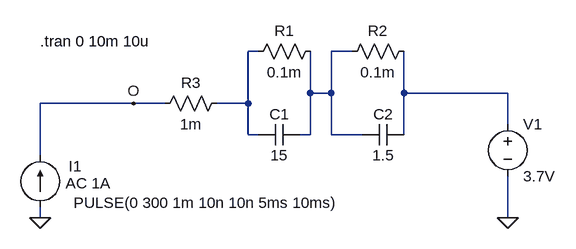
[diagram p0: schematic Lithium-Ion Battery Model - Current Pulse Simulation.asc]
Lithium-Ion Battery Model - Current Pulse Simulation.asc, the LTspice schematic file:
Version 4
SHEET 1 880 680
WIRE 128 48 112 48
WIRE 272 48 240 48
WIRE 208 112 208 48
WIRE 240 112 240 48
WIRE 240 112 208 112
WIRE 352 112 352 48
WIRE 512 112 352 112
WIRE -64 128 -208 128
WIRE -16 128 -64 128
WIRE 112 128 112 48
WIRE 112 128 64 128
WIRE 512 160 512 112
WIRE 112 176 112 128
WIRE 128 176 112 176
WIRE 208 176 208 112
WIRE 208 176 192 176
WIRE 240 176 240 112
WIRE 288 176 240 176
WIRE 352 176 352 112
WIRE -208 208 -208 128
WIRE -208 304 -208 288
WIRE 512 304 512 240
FLAG 512 304 0
FLAG -208 304 0
FLAG -64 128 O
SYMBOL cap 128 160 M90
WINDOW 0 0 32 VBottom 2
WINDOW 3 32 32 VTop 2
SYMATTR InstName C1
SYMATTR Value 15
SYMBOL cap 288 160 M90
WINDOW 0 0 32 VBottom 2
WINDOW 3 32 32 VTop 2
SYMATTR InstName C2
SYMATTR Value 1.5
SYMBOL res 112 64 R270
WINDOW 0 32 56 VTop 2
WINDOW 3 0 56 VBottom 2
SYMATTR InstName R1
SYMATTR Value 0.1m
SYMBOL res 256 64 R270
WINDOW 0 32 56 VTop 2
WINDOW 3 0 56 VBottom 2
SYMATTR InstName R2
SYMATTR Value 0.1m
SYMBOL res -32 144 R270
WINDOW 0 32 56 VTop 2
WINDOW 3 0 56 VBottom 2
SYMATTR InstName R3
SYMATTR Value 1m
SYMBOL voltage 512 144 R0
WINDOW 123 0 0 Left 0
WINDOW 39 0 0 Left 0
SYMATTR InstName V1
SYMATTR Value 3.7V
SYMBOL current -208 288 M180
WINDOW 0 54 79 Bottom 2
WINDOW 3 256 -8 Top 2
WINDOW 123 74 22 Top 2
WINDOW 39 0 0 Left 0
SYMATTR InstName I1
SYMATTR Value PULSE(0 300 1m 10n 10n 5ms 10ms)
SYMATTR Value2 AC 1A
TEXT -208 32 Left 2 !.tran 0 10m 10u

The netlist it stands for:
* Lithium-Ion Battery Model - Current Pulse Simulation.asc
C1 N001 N002 15
C2 N002 N003 1.5
R1 N001 N002 0.1m
R2 N002 N003 0.1m
R3 O N001 1m
V1 N003 0 3.7V
I1 0 O PULSE(0 300 1m 10n 10n 5ms 10ms) AC 1A
.tran 0 10m 10u
.backanno
.end